# Altium schematic sheet WC_MODEM.SchDoc
size A; Organization: Altium Limited; Address1: L3, 12a Rodborough Rd; Address2: Frenchs Forest; Address3: NSW; Address4: Australia 2086; DocumentNumber: 9; SheetNumber: 9; SheetTotal: 11
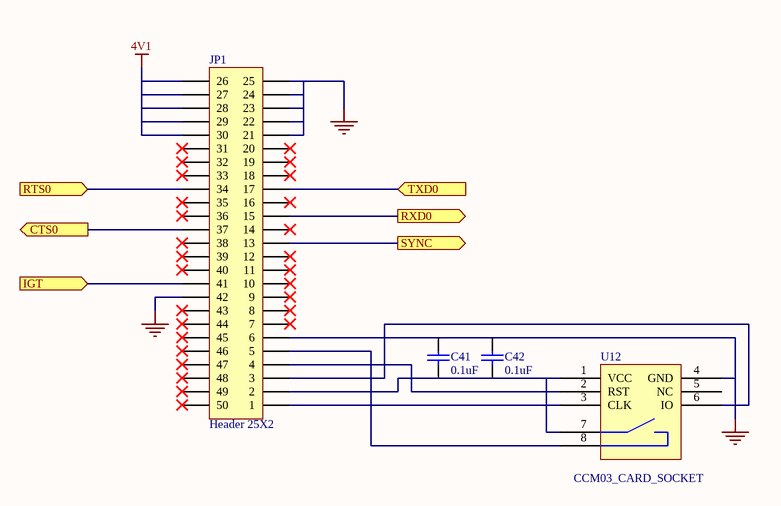
[diagram p0: WC_MODEM.SchDoc]

## Parts
C41  0.1uF  [CC2012-0805]
C42  0.1uF  [CC2012-0805]
JP1  Header 25X2  [MC45]
U12  CCM03_CARD_SOCKET  [CCM03_MKIII]

## Ports
CTS0 (out), IGT (in), RTS0 (in), RXD0 (out), SYNC (out), TXD0 (in)

## Nets
4V1: JP1.26 JP1.27 JP1.28 JP1.29 JP1.30
GND: C41.2 C42.2 JP1.6 JP1.21 JP1.22 JP1.23 JP1.24 JP1.25 JP1.42 U12.4(GND)
CTS0: JP1.37 ; port CTS0
IGT: JP1.41 ; port IGT
RTS0: JP1.34 ; port RTS0
RXD0: JP1.15 ; port RXD0
SYNC: JP1.13 ; port SYNC
TXD0: JP1.17 ; port TXD0
NetC41_1: C41.1 C42.1 JP1.2 U12.1(VCC) U12.7
NetJP1_1: JP1.1 U12.3(CLK)
NetJP1_3: JP1.3 U12.6(IO)
NetJP1_4: JP1.4 U12.2(RST)
NetJP1_5: JP1.5 U12.8

Not connected (* = marked no-connect by the designer): JP1 7* 8* 9* 10* 11* 12* 14* 16* 18* 19* 20* 31* 32* 33* 35* 36* 38* 39* 40* 43* 44* 45* 46* 47* 48* 49* 50*; U12 5(NC)

## Notes on the sheet
- Title
- Size:
- Date:
- A
- Number:
- Time:
- Revision:
- Sheet
- of
- File:

## Library data of the parts
C41 C42 = CAP: Capacitor
JP1 = Header 25X2: Header, 25-Pin, Dual row; Manufacturer: Generic Components; Class I: Connector; Revision: July-2002: Re-released for DXP Platform.; Publisher: Altium Limited
U12 = CCM03_CARD_SOCKET: SIM/SAM card connector with card detection switch